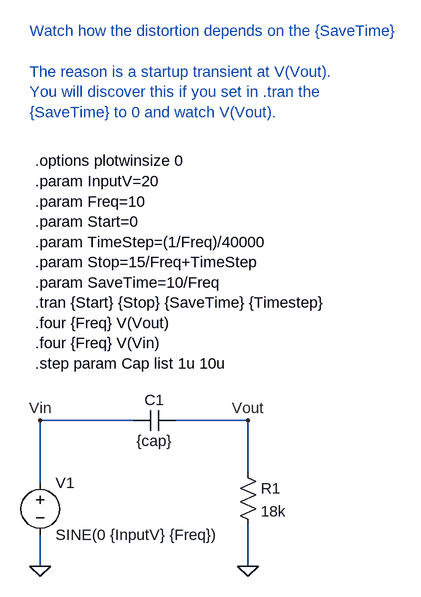
[diagram p0: schematic Highpass.asc]
Highpass.asc, the LTspice schematic file:
Version 4
SHEET 1 880 680
WIRE 48 80 160 80
WIRE 160 80 160 160
WIRE -16 80 -160 80
WIRE -160 80 -160 176
WIRE -160 256 -160 304
WIRE 160 240 160 304
FLAG -160 304 0
FLAG 160 304 0
FLAG 160 80 Vout
FLAG -160 80 Vin
SYMBOL voltage -160 160 R0
SYMATTR InstName V1
SYMATTR Value SINE(0 {InputV} {Freq})
SYMBOL res 144 144 R0
SYMATTR InstName R1
SYMATTR Value 18k
SYMBOL cap -16 96 R270
WINDOW 0 32 32 VTop 0
WINDOW 3 0 32 VBottom 0
SYMATTR InstName C1
SYMATTR Value {cap}
TEXT -168 -320 Left 0 !.options plotwinsize 0\n.param InputV=20\n.param Freq=10\n.param Start=0\n.param TimeStep=(1/Freq)/40000\n.param Stop=15/Freq+TimeStep\n.param SaveTime=10/Freq\n.tran {Start} {Stop} {SaveTime} {Timestep}\n.four {Freq} V(Vout)\n.four {Freq} V(Vin)\n.step param Cap list 1u 10u
TEXT -176 -520 Left 0 ;Watch how the distortion depends on the {SaveTime}\n \nThe reason is a startup transient at V(Vout).\nYou will discover this if you set in .tran the \n{SaveTime} to 0 and watch V(Vout).

The netlist it stands for:
* Highpass.asc
V1 Vin 0 SINE(0 {InputV} {Freq})
R1 Vout 0 18k
C1 Vin Vout {cap}
.options plotwinsize 0
.param InputV=20
.param Freq=10
.param Start=0
.param TimeStep=(1/Freq)/40000
.param Stop=15/Freq+TimeStep
.param SaveTime=10/Freq
.tran {Start} {Stop} {SaveTime} {Timestep}
.four {Freq} V(Vout)
.four {Freq} V(Vin)
.step param Cap list 1u 10u
* Watch how the distortion depends on the {SaveTime}
* The reason is a startup transient at V(Vout).
* You will discover this if you set in .tran the
* {SaveTime} to 0 and watch V(Vout).
.backanno
.end